# Altium schematic sheet Control_Sense_TOPMOS.SchDoc (part 4 of 4)
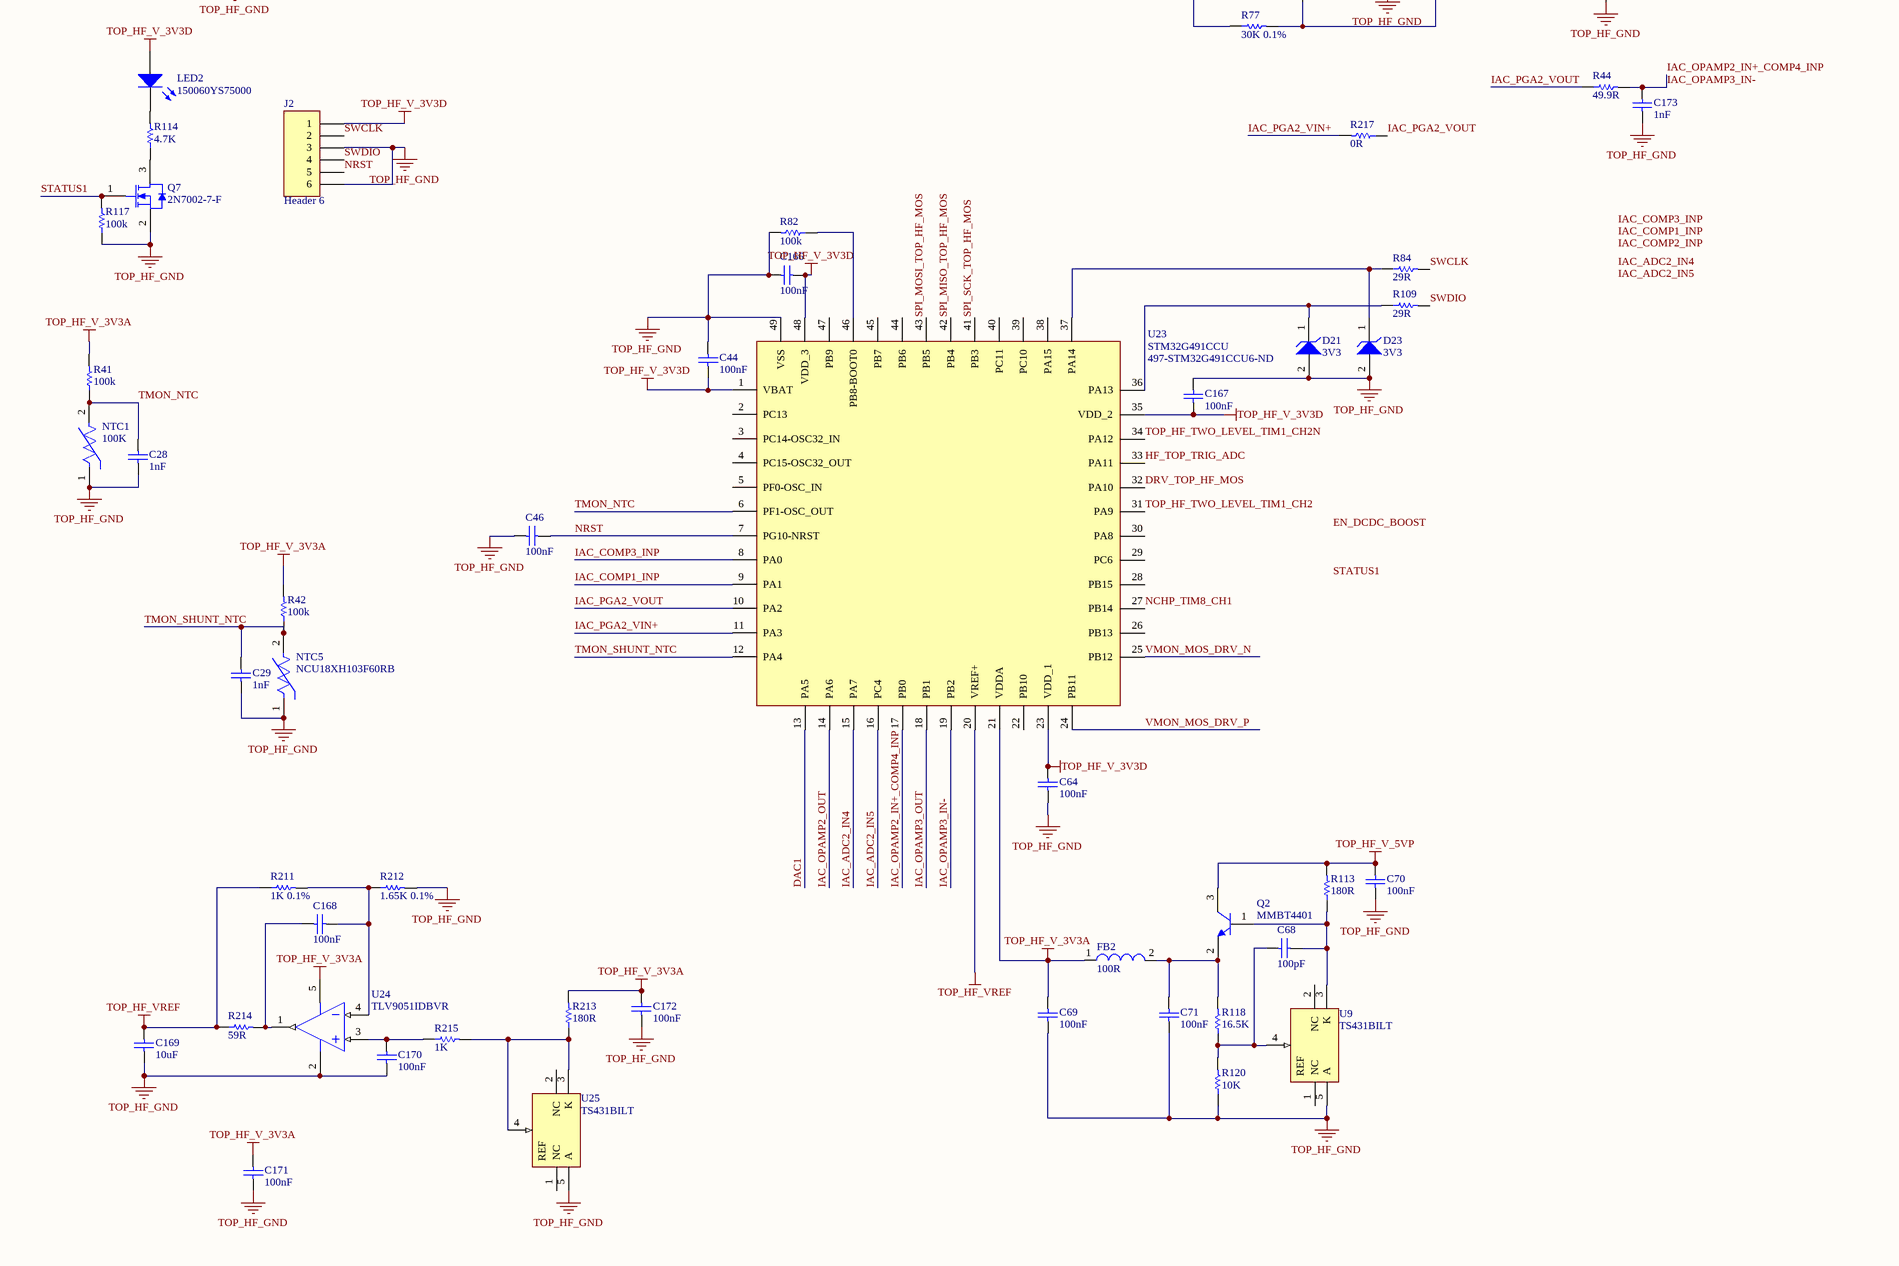
[diagram p4: Control_Sense_TOPMOS.SchDoc, bottom]

## Library data of the parts (continued)
R212 = CMP-2000-00927-1: Part Number: ERA3AEB1651V; Manufacturer: Panasonic; Manufacturer Part Number: ERA-3AEB1651V; Resistance: 1.65kR; Power Rating: 100mW; Voltage Rating: 75V; Temperature Coefficient: 25ppm/°C; Supplier 1: Digi-Key; Supplier Part Number 1: P1.65KDBCT-ND; RoHS: Yes; Category: Chip SMD Resistors; Stock 1: 109834; Pricing 1: 1=0.31000, 10=0.26000, 100=0.10150, 1000=0.04248, 2500=0.03894 (USD); Mount: Surface Mount; Case/Package: 0603; Number of Pins: 2; Case Code (Imperial): 0603; Case Code (Metric): 1608; Contact Plating: Tin; Min Operating Temperature: -55°C; Max Operating Temperature: 155°C; Packaging: Tape and Reel; Tolerance: 0.1%; Resistor Type: Metal Film,Thin Film; Number of Terminations: 2; Package Quantity: 1; Voltage Rating (DC): 75V; Max Power Dissipation: 100mW; Features: Automotive AEC-Q200; Length: 1.6mm; Width: 0.8mm; Height: 0.45mm; Depth: 0.8mm; Radiation Hardening: No; REACH SVHC: No SVHC; Lead Free: Lead Free; Military Standard: Not; ComponentLink1URL: https://datasheet.ciiva.com/11809/0900766b80eb1d8c-11809743.pdf?src-supplier=RSComponents; ComponentLink1Description: https://datasheet.ciiva.com/11809/0900766b80eb1d8c-11809743.pdf?src-supplier=RSComponents; ComponentLink2URL: https://datasheet.ciiva.com/29183/451859-da-01-en-widerstand-0603-era-29183902.pdf?src-supplier=Conrad; ComponentLink2Description: https://datasheet.ciiva.com/29183/451859-da-01-en-widerstand-0603-era-29183902.pdf?src-supplier=Conrad; ComponentLink3URL: https://datasheet.ciiva.com/9197/aoa0000ce26-9197850.pdf?src-supplier=Avnet; ComponentLink3Description: https://datasheet.ciiva.com/9197/aoa0000ce26-9197850.pdf?src-supplier=Avnet; ComponentLink4URL: https://datasheet.ciiva.com/17214/aoa0000ce26-17214586.pdf?src-supplier=Avnet+Europe; ComponentLink4Description: https://datasheet.ciiva.com/17214/aoa0000ce26-17214586.pdf?src-supplier=Avnet+Europe; ComponentLink5URL: https://datasheet.ciiva.com/7920/485442-7920363.pdf?src-supplier=Element14; ComponentLink5Description: https://datasheet.ciiva.com/7920/485442-7920363.pdf?src-supplier=Element14; ComponentLink6URL: https://datasheet.ciiva.com/7920/485442-7920364.pdf?src-supplier=Element14; ComponentLink6Description: https://datasheet.ciiva.com/7920/485442-7920364.pdf?src-supplier=Element14
R214 = CMP-2000-00583-1: Manufacturer: Panasonic; Part Number: ERJ-3EKF59R0V; Power Rating: 100mW; Tolerance: 1%; Temperature Coefficient: 100ppm/°C; Voltage Rating: 75V; Voltage Rating (DC): 50V; Supplier 1: Digi-Key; Supplier Part Number 1: P59.0HCT-ND; Manufacturer Part Number: ERJ-3EKF59R0V; RoHS: Yes; Category: Chip SMD Resistors; Stock 1: 39151; Pricing 1: 1=0.10000, 10=0.03700, 100=0.01490, 1000=0.00670, 2500=0.00582 (USD); Mount: Surface Mount; Case/Package: 0603; Case Code (Metric): 1608; Case Code (Imperial): 0603; Contact Plating: Tin; Min Operating Temperature: -55°C; Max Operating Temperature: 155°C; Resistance: 59R; Packaging: Tape and Reel; Resistor Type: Thick Film; Number of Terminations: 2; Package Quantity: 1; Series: ERJ; Max Power Dissipation: 100mW; Termination: SMD/SMT; Resistance Tolerance: 1%; Features: Automotive AEC-Q200; Technology: THICK FILM; Construction: Rectangular; Length: 1.6mm; Width: 0.031inch; Height: 0.45mm; Depth: 0.8mm; RoHS Compliant: Yes; REACH SVHC: Yes; Lead Free: Contains Lead; Military Standard: Not; ComponentLink1URL: https://datasheet.ciiva.com/9188/aoa0000ce2-9188485.pdf?src-supplier=Avnet; ComponentLink1Description: https://datasheet.ciiva.com/9188/aoa0000ce2-9188485.pdf?src-supplier=Avnet; ComponentLink2URL: https://datasheet.ciiva.com/46420/1678782-46420341.pdf?src-supplier=Element14; ComponentLink2Description: https://datasheet.ciiva.com/46420/1678782-46420341.pdf?src-supplier=Element14; ComponentLink3URL: https://datasheet.ciiva.com/22729/1678782-22729158.pdf?src-supplier=Farnell; ComponentLink3Description: https://datasheet.ciiva.com/22729/1678782-22729158.pdf?src-supplier=Farnell; ComponentLink4URL: https://datasheet.ciiva.com/22673/1678782-22673800.pdf?src-supplier=Element14; ComponentLink4Description: https://datasheet.ciiva.com/22673/1678782-22673800.pdf?src-supplier=Element14; ComponentLink5URL: https://datasheet.ciiva.com/9188/aoa0000ce2-9188489.pdf?src-supplier=Avnet; ComponentLink5Description: https://datasheet.ciiva.com/9188/aoa0000ce2-9188489.pdf?src-supplier=Avnet; ComponentLink6URL: https://datasheet.ciiva.com/30242/aoa0000ce2-30242153.pdf?src-supplier=Onlinecomponents.com; ComponentLink6Description: https://datasheet.ciiva.com/30242/aoa0000ce2-30242153.pdf?src-supplier=Onlinecomponents.com; ComponentLink7URL: https://datasheet.ciiva.com/16777/70260748-16777979.pdf?src-supplier=Allied+Electronics; ComponentLink7Description: https://datasheet.ciiva.com/16777/70260748-16777979.pdf?src-supplier=Allied+Electronics
U4 U9 = PM-REF-431-IL5: 30mA, Low voltage adjustable shunt reference, 1.24 to 6V, 5-Pin SOT23-5, Tape and Reel; ComponentLink1URL: http://www.st.com; ComponentLink1Description: Manufacturer URL; ComponentLink2URL: http://www.st.com/internet/com/TECHNICAL_RESOURCES/TECHNICAL_LITERATURE/DATASHEET/CD00001336.pdf; PackageVersion: 2010; ComponentLink2Description: Datasheet; PackageReference: SOT23-5; PackageDescription: 5-Pin SOT-23 Package, 2.9 x 1.6 mm Body, 0.95 mm Pitch, 2.8 mm Lead Span; DatasheetVersion: Aug-2010
U6 = CMP-0859-00394-3: Single 2-Input Positive-AND Gate, DCK0005A, SMALL T&R; Generic Part Number: SN74AHC1G08; Manufacturer: Texas Instruments; Schmitt Trigger: No; ICC @ Nom Voltage(Max)(mA): 0.01; Technology Family: AHC; Output Drive (IOL/IOH)(Max)(mA): 50/-50; tpd @ Nom Voltage(Max)(ns): 12.3,7.9; Logic: True; Gate Type: AND; VCC(Min)(V): 2; Input Type: CMOS; Voltage(Nom)(V): 3.3,5; Bits(#): 1; VCC(Max)(V): 5.5; F @ Nom Voltage(Max)(Mhz): 75; Rating: Catalog; 3-State Output: No; Operating Temperature Range(C): -55 to 125; DatasheetVersion: SCLS314N; Sub-Family: AND Gate; Output Type: CMOS; PackageReference: DCK0005A
U7 = 1EDN8550B: Single-channel EiceDRIVER™ with true  differential inputs
U8 = CMP-0272-01102-3: 1 MHz, 45 uA, RRIO, Single Operational Amplifier, 2.1 to 5.5 V, -40 to 125 degC, 5-pin SOT23 (DCK5), Green (RoHS & no Sb/Br); PartNumber: OPA348AIDCKT; Manufacturer: Texas Instruments; Vio (25C)(Max)(mV): 5; Total Supply Voltage(Max)(+5V is 5, +/-5V is 10): 5.5; Slew Rate(Typ)(V/us): 0.5; Iq per channel(Max)(mA): 0.065; Number of Channels: 1; IIB(Max)(pA): 10; Packing: SMALL T&R; Offset Drift(Typ)(uV/C): 4; Sub Family: Low Input Bias Current Amp (<=10pA), Low Power Amp (<=500uA), Low Supply Voltage Amplifier (<=2.7V), Precision Amplifier; CMRR(Min)(dB): 70; Rating: Catalog; Total Supply Voltage(Min)(+5V is 5, +/-5V is 10): 2.1; Code_JEDEC: MO-203; ComponentLink2Description: Datasheet; Mounting Technology: Surface Mount; ComponentLink1URL: http://www.ti.com/; ComponentLink3URL: http://www.ti.com/litv/pdf/mpds025f; PackageVersion: 4093553-3/G, 01/2007; DatasheetVersion: SBOS213G; PackageReference: DCK0005A; ComponentLink2URL: http://www.ti.com/lit/ds/symlink/opa348.pdf; PackageDescription: 5-Pin Plastic Small Outline, Body 2 x 1.25 mm, Pitch 0.65 mm; GBW(Typ)(MHz): 1; ComponentLink3Description: Package Specification; ComponentLink1Description: Manufacturer URL; Eco-Plan: Green (RoHS & no Sb/Br)
U23 = STM32G491CCU: Manufacturer: STMicroelectronics; Manufacturer Part Number: STM32G491CCU6; Supplier 1: Digi-Key; RoHS: Yes
U24 = CMP-0187-00454-2: 2.8 MHz, 150 Î¼A Op Amp, 5-Pin SOT-23, Extended Temperature Range, Tape and Reel; Code_IPC: SOT23-5; PackageDescription: 5-Lead Plastic Small Outline Transistor (OT) [SOT-23]; PackageReference: SOT-23-OT5; ComponentLink3URL: http://www.microchip.com/stellent/groups/techpub_sg/documents/packagingspec/en012702.pdf; ComponentLink1Description: Manufacturer URL; ComponentLink2URL: http://ww1.microchip.com/downloads/en/DeviceDoc/22145a.pdf; ComponentLink2Description: Datasheet; PackageVersion: revBB, Aug-2009; RevisionNote: URLs added.; ComponentLink1URL: http://www.microchip.com/; DatasheetVersion: revA, Mar-2009; ComponentLink3Description: Package Specification
U25 = CMP-0242-00042-1: 30mA, Low voltage adjustable shunt reference, 1.24 to 6V, 5-Pin SOT23-5, Tape and Reel; ComponentLink1URL: http://www.st.com; ComponentLink1Description: Manufacturer URL; ComponentLink2URL: http://www.st.com/internet/com/TECHNICAL_RESOURCES/TECHNICAL_LITERATURE/DATASHEET/CD00001336.pdf; PackageVersion: 2010; ComponentLink2Description: Datasheet; PackageReference: SOT23-5; PackageDescription: 5-Pin SOT-23 Package, 2.9 x 1.6 mm Body, 0.95 mm Pitch, 2.8 mm Lead Span; DatasheetVersion: Aug-2010